# EAGLE schematic control_bdr (EAGLE 9.6.2)
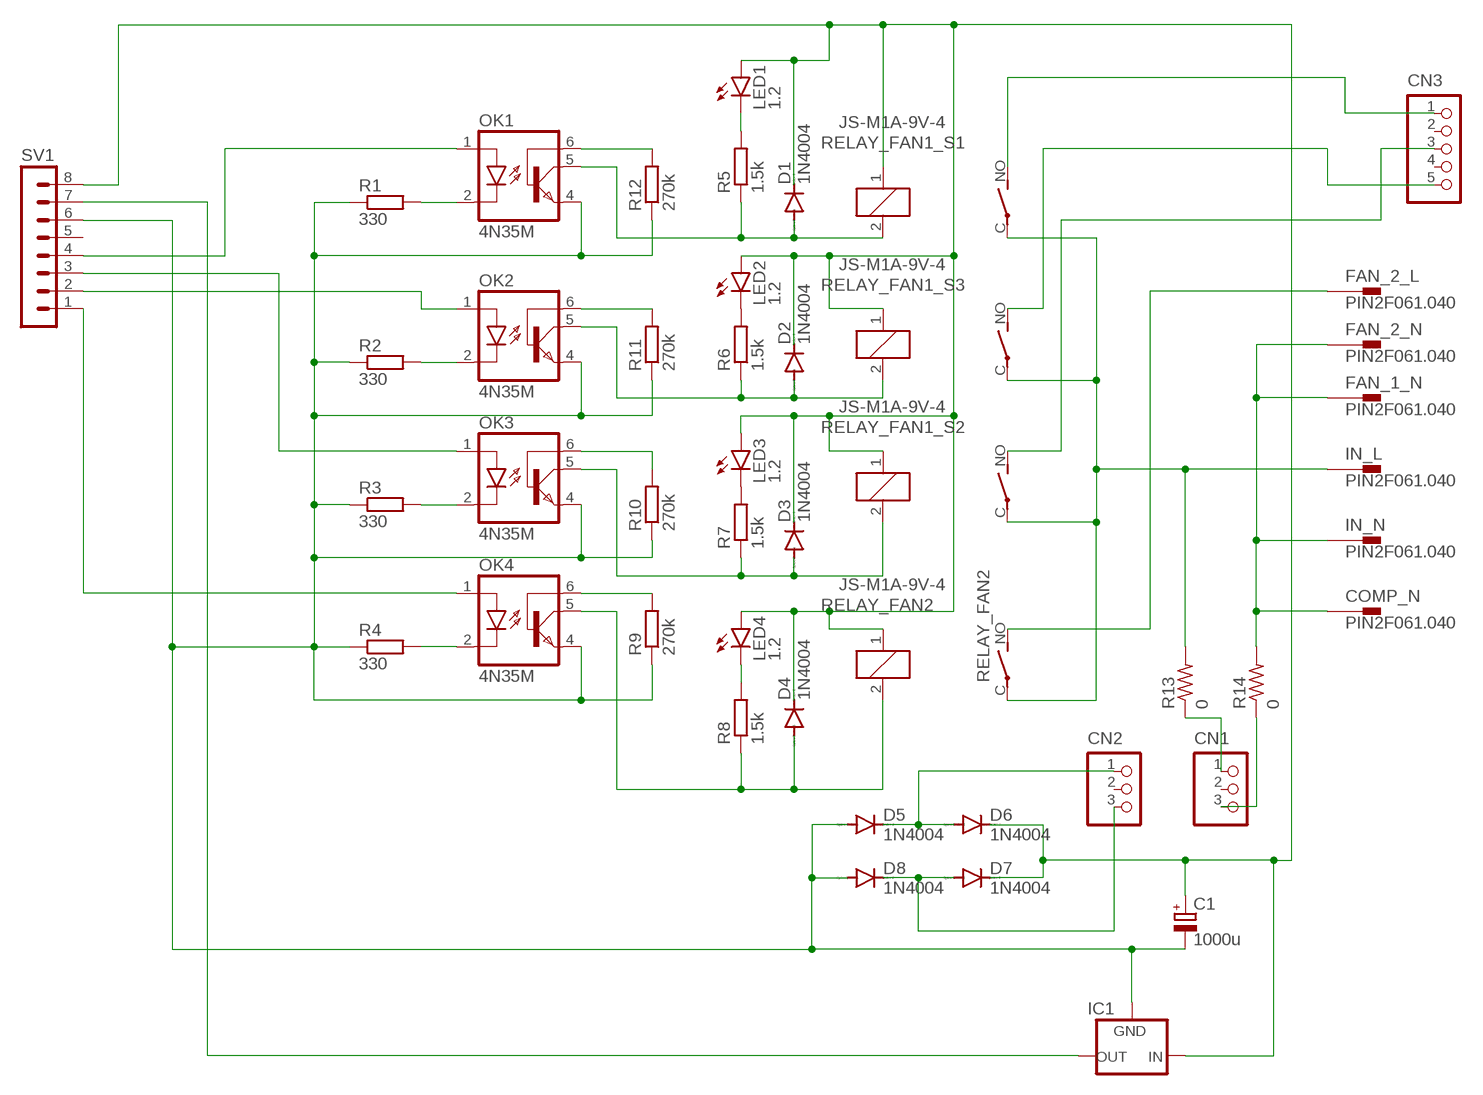
[diagram p0: schematic, sheet 1]

## Parts
C1  1000u  CPOL-EUE3.5-10  [E3,5-10]
CN1  B3P-VH  [B3P-VH]
CN2  B3B-XASK-1  [B3B-XASK-1]
CN3  B5P-VH  [B5P-VH]
COMP_N  PIN2F061.040  [F061.040]
D1  1N4004  [DO41-10]
D2  1N4004  [DO41-10]
D3  1N4004  [DO41-10]
D4  1N4004  [DO41-10]
D5  1N4004  [DO41-10]
D6  1N4004  [DO41-10]
D7  1N4004  [DO41-10]
D8  1N4004  [DO41-10]
FAN_1_N  PIN2F061.040  [F061.040]
FAN_2_L  PIN2F061.040  [F061.040]
FAN_2_N  PIN2F061.040  [F061.040]
IC1  78XXL  [78XXL]
IN_L  PIN2F061.040  [F061.040]
IN_N  PIN2F061.040  [F061.040]
LED1  1.2  LED5MM  [LED5MM]
LED2  1.2  LED5MM  [LED5MM]
LED3  1.2  LED5MM  [LED5MM]
LED4  1.2  LED5MM  [LED5MM]
OK1  4N35M  [DIL06]
OK2  4N35M  [DIL06]
OK3  4N35M  [DIL06]
OK4  4N35M  [DIL06]
R1  330  R-EU_0204/7  [0204/7]
R2  330  R-EU_0204/7  [0204/7]
R3  330  R-EU_0204/7  [0204/7]
R4  330  R-EU_0204/7  [0204/7]
R5  1.5k  R-EU_0204/7  [0204/7]
R6  1.5k  R-EU_0204/7  [0204/7]
R7  1.5k  R-EU_0204/7  [0204/7]
R8  1.5k  R-EU_0204/7  [0204/7]
R9  270k  R-EU_0204/7  [0204/7]
R10  270k  R-EU_0204/7  [0204/7]
R11  270k  R-EU_0204/7  [0204/7]
R12  270k  R-EU_0204/7  [0204/7]
R13  0  R-US_0204/2V  [0204V]
R14  0  R-US_0204/2V  [0204V]
RELAY_FAN1_S1  JS-M1A-9V-4  [JS-M1A]
RELAY_FAN1_S2  JS-M1A-9V-4  [JS-M1A]
RELAY_FAN1_S3  JS-M1A-9V-4  [JS-M1A]
RELAY_FAN2  JS-M1A-9V-4  [JS-M1A]
SV1  MA08-1  [MA08-1]

## Nets
N$1 [AC_IN_HIGH]: IN_L.A1 IN_L.A2 R13.2 RELAY_FAN1_S1.C(2:P) RELAY_FAN1_S2.C(2:P) RELAY_FAN1_S3.C(2:P) RELAY_FAN2.C(2:P)
N$2 [FAN_1_IN]: CN3.1 RELAY_FAN1_S1.NO(2:S)
N$3 [FAN_1_IN]: CN3.5 RELAY_FAN1_S3.NO(2:S)
N$4 [FAN_1_IN]: CN3.3 RELAY_FAN1_S2.NO(2:S)
N$5 [FAN_2_IN]: FAN_2_L.A1 FAN_2_L.A2 RELAY_FAN2.NO(2:S)
N$6 [AC_IN_HIGH]: COMP_N.A1 COMP_N.A2 FAN_1_N.A1 FAN_1_N.A2 FAN_2_N.A1 FAN_2_N.A2 IN_N.A1 IN_N.A2 R14.2
N$7 [dc_v]: OK1.2(C) R1.2
N$8 [dc_v]: OK2.2(C) R2.2
N$9 [dc_v]: OK3.2(C) R3.2
N$10 [dc_v]: OK4.2(C) R4.2
N$11 [gnd]: C1.- D5.A D8.A IC1.GND OK1.4(EMI) OK2.4(EMI) OK3.4(EMI) OK4.4(EMI) R1.1 R2.1 R3.1 R4.1 R9.1 R10.1 R11.1 R12.1 SV1.6
N$12 [dc_v]: LED2.K(C) R6.2
N$13 [dc_v]: LED1.K(C) R5.2
N$14 [dc_v]: LED3.K(C) R7.2
N$15 [dc_v]: LED4.K(C) R8.2
N$16 [AC_IN_LOW_CURR]: CN1.1 R13.1
N$17 [AC_IN_LOW_CURR]: CN1.3 R14.1
N$18 [dc_v]: OK4.6(BAS) R9.2
N$19 [dc_v]: OK3.6(BAS) R10.2
N$20 [dc_v]: OK2.6(BAS) R11.2
N$21 [dc_v]: OK1.6(BAS) R12.2
N$22 [dc_12v]: CN2.1 D5.C D6.A
N$23 [dc_v]: IC1.OUT SV1.7
N$24 [dc_12v]: CN2.3 D7.A D8.C
N$25 [dc_v]: OK2.1(A) SV1.2
N$26 [dc_v]: D4.A OK4.5(COL) R8.1 RELAY_FAN2.2
N$27 [dc_v]: D3.A OK3.5(COL) R7.1 RELAY_FAN1_S2.2
N$28 [dc_v]: D2.A OK2.5(COL) R6.1 RELAY_FAN1_S3.2
N$29 [dc_v]: D1.A OK1.5(COL) R5.1 RELAY_FAN1_S1.2
N$30 [dc_v]: OK1.1(A) SV1.4
N$32 [dc_v]: OK3.1(A) SV1.3
N$33 [dc_v]: OK4.1(A) SV1.1
N$34 [dc_12v]: C1.+ D1.C D2.C D3.C D4.C D6.C D7.C IC1.IN LED1.A LED2.A LED3.A LED4.A RELAY_FAN1_S1.1 RELAY_FAN1_S2.1 RELAY_FAN1_S3.1 RELAY_FAN2.1 SV1.8
Unconnected: CN1.2 CN2.2 CN3.2 CN3.4 SV1.5

## Library data of the parts
C1 = rcl:CPOL-EU: POLARIZED CAPACITOR, European symbol; SPICEPREFIX: C
CN1 = jst-vh:B3P-VH: Wire-to-Board 3.96mm pitch top mount connector Source: http://www.jst-mfg.com/product/pdf/jpn/VH.pdf http://www.jst-mfg.com/product/detail.php?series=262
CN2 = jst-xa:B3B-XASK-1: Wire-to-Board 2.5mm pitch top mount connector Source: http://www.jst-mfg.com/product/pdf/jpn/XA1.pdf http://www.jst-mfg.com/product/detail.php?series=272
CN3 = jst-vh:B5P-VH: Wire-to-Board 3.96mm pitch top mount connector Source: http://www.jst-mfg.com/product/pdf/jpn/VH.pdf http://www.jst-mfg.com/product/detail.php?series=262
COMP_N FAN_1_N FAN_2_L FAN_2_N IN_L IN_N = con-faston:PIN2: Flachstecker Typ Tyco/Electronics/AMP TAB, FASTON Printed Circuit Board Tabs Source: http://www.buerklin.com, http://catalog.tycoelectronics.com; OC_FARNELL: unknown; OC_NEWARK: unknown
D1-D8 = diode:1N4004: DIODE general purpose rectifier, 1 A
IC1 = v-reg:78XXL: VOLTAGE REGULATOR
LED1-LED4 = led:LED: LED OSRAM: - CHIPLED LG R971, LG N971, LY N971, LG Q971, LY Q971, LO R971, LY R971 LH N974, LH R974 LS Q976, LO Q976, LY Q976 LO Q996 - Hyper CHIPLED LW Q18S LB Q993, LB Q99A, LB R99A - SideLED LS A670, LO A670, LY A670, LG A670, LP A670 LB A673, LV A673, LT A673, LW A673 LH A674 LY A675 LS A676, LA A676, LO A676, LY A676, LW A676 LS A679, LY A679, LG A679 - Hyper Micro SIDELED® LS Y876, LA Y876, LO Y876, LY Y876 LT Y87S - SmartLED LW L88C, LW L88S LB L89C, LB L89S, LG L890 LS L89K, LO L89K, LY L89K LS L896, LA L896, LO L896, LY L896 - TOPLED LS T670, LO T670, LY T670, LG T670, LP T670 LSG T670, LSP T670, LSY T670, LOP T670, LYG T670 LG T671, LOG T671, LSG T671 LB T673, LV T673, LT T673, LW T673 LH T674 LS T676, LA T676, LO T676, LY T676, LB T676, LH T676, LSB T676, LW T676 LB T67C, LV T67C, LT T67C, LS T67K, LO T67K, LY T67K, LW E67C LS E67B, LA E67B, LO E67B, LY E67B, LB E67C, LV E67C, LT E67C LW T67C LS T679, LY T679, LG T679 LS T770, LO T770, LY T770, LG T770, LP T770 LB T773, LV T773, LT T773, LW T773 LH T774 LS E675, LA E675, LY E675, LS T675 LS T776, LA T776, LO T776, LY T776, LB T776 LHGB T686 LT T68C, LB T68C - Hyper Mini TOPLED® LB M676 - Mini TOPLED Santana® LG M470 LS M47K, LO M47K, LY M47K Source: http://www.osram.convergy.de LUXEON: - LUMILED® LXK2-PW12-R00, LXK2-PW12-S00, LXK2-PW14-U00, LXK2-PW14-V00 LXK2-PM12-R00, LXK2-PM12-S00, LXK2-PM14-U00 LXK2-PE12-Q00, LXK2-PE12-R00, LXK2-PE12-S00, LXK2-PE14-T00, LXK2-PE14-U00 LXK2-PB12-K00, LXK2-PB12-L00, LXK2-PB12-M00, LXK2-PB14-N00, LXK2-PB14-P00, LXK2-PB14-Q00 LXK2-PR12-L00, LXK2-PR12-M00, LXK2-PR14-Q00, LXK2-PR14-R00 LXK2-PD12-Q00, LXK2-PD12-R00, LXK2-PD12-S00 LXK2-PH12-R00, LXK2-PH12-S00 LXK2-PL12-P00, LXK2-PL12-Q00, LXK2-PL12-R00 Source: www.luxeon.com KINGBRIGHT: KA-3528ASYC Source: www.kingbright.com
OK1-OK4 = optocoupler:4N*?M: General Purpose 6-Pin Phototransistor Optocouplers Source: http://www.fairchildsemi.com/ds/4N/4N35-M.pdf; MPN: 4N35-M; OC_FARNELL: 1021351; OC_NEWARK: 98K9114
R1-R12 = rcl:R-EU_: RESISTOR, European symbol; SPICEPREFIX: R
R13 R14 = rcl:R-US_: RESISTOR, American symbol; SPICEPREFIX: R
RELAY_FAN1_S1-RELAY_FAN1_S3 RELAY_FAN2 = relay:JS-M1A*: Automotive Ultra-Miniature Power Relay NAiS Source: http://www.mew-europe.com/.. en_ds_61211_0000.pdf; OC_FARNELL: unknown; OC_NEWARK: unknown
SV1 = con-lstb:MA08-1: PIN HEADER; OC_FARNELL: unknown; OC_NEWARK: unknown

## Net classes
1 AC_IN_HIGH: width 10.16 mm, clearance 0.61 mm
2 FAN_1_IN: width 3.81 mm, clearance 0.61 mm
3 FAN_2_IN: width 5.08 mm, clearance 0.61 mm
4 AC_IN_LOW: width 7.62 mm, clearance 0.61 mm
5 dc_v: width 0.406 mm, clearance 0.051 mm
6 dc_12v: width 0.406 mm, clearance 0.051 mm
7 AC_IN_LOW_CURR: width 0.813 mm, clearance 0.61 mm
8 gnd: width 0.406 mm, clearance 0.051 mm